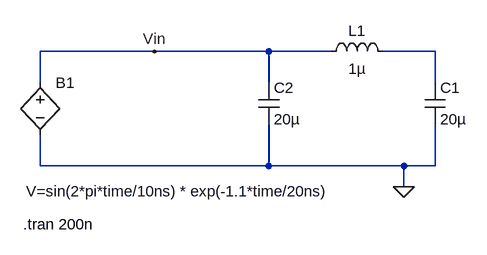
[diagram p0: schematic CyclRing.asc]
CyclRing.asc, the LTspice schematic file:
Version 4
SHEET 1 880 680
WIRE -304 160 -304 112
WIRE -304 288 -304 240
WIRE -128 112 -304 112
WIRE 48 112 -128 112
WIRE 48 160 48 112
WIRE 48 288 -304 288
WIRE 48 288 48 224
WIRE 144 112 48 112
WIRE 256 288 48 288
WIRE 256 320 256 288
WIRE 304 112 224 112
WIRE 304 160 304 112
WIRE 304 288 256 288
WIRE 304 288 304 224
FLAG 256 320 0
FLAG -128 112 Vin
SYMBOL ind 128 128 R270
WINDOW 0 32 56 VTop 0
WINDOW 3 5 56 VBottom 0
SYMATTR InstName L1
SYMATTR Value 1µ
SYMBOL cap 288 160 R0
SYMATTR InstName C1
SYMATTR Value 20µ
SYMATTR SpiceLine Rser=.001 Lser=4n
SYMBOL cap 32 160 R0
SYMATTR InstName C2
SYMATTR Value 20µ
SYMATTR SpiceLine Rser=0.001 Lser=4n
SYMBOL bv -304 144 R0
WINDOW 3 -22 183 Left 0
SYMATTR InstName B1
SYMATTR Value V=sin(2*pi*time/10ns) * exp(-1.1*time/20ns)
TEXT -330 378 Left 0 !.tran 200n

The netlist it stands for:
* CyclRing.asc
L1 Vin N001 1µ
C1 N001 0 20µ Rser=.001 Lser=4n
C2 Vin 0 20µ Rser=0.001 Lser=4n
B1 Vin 0 V=sin(2*pi*time/10ns) * exp(-1.1*time/20ns)
.tran 200n
.backanno
.end